# Altium schematic sheet 1_PowerSupply.SchDoc
size A4
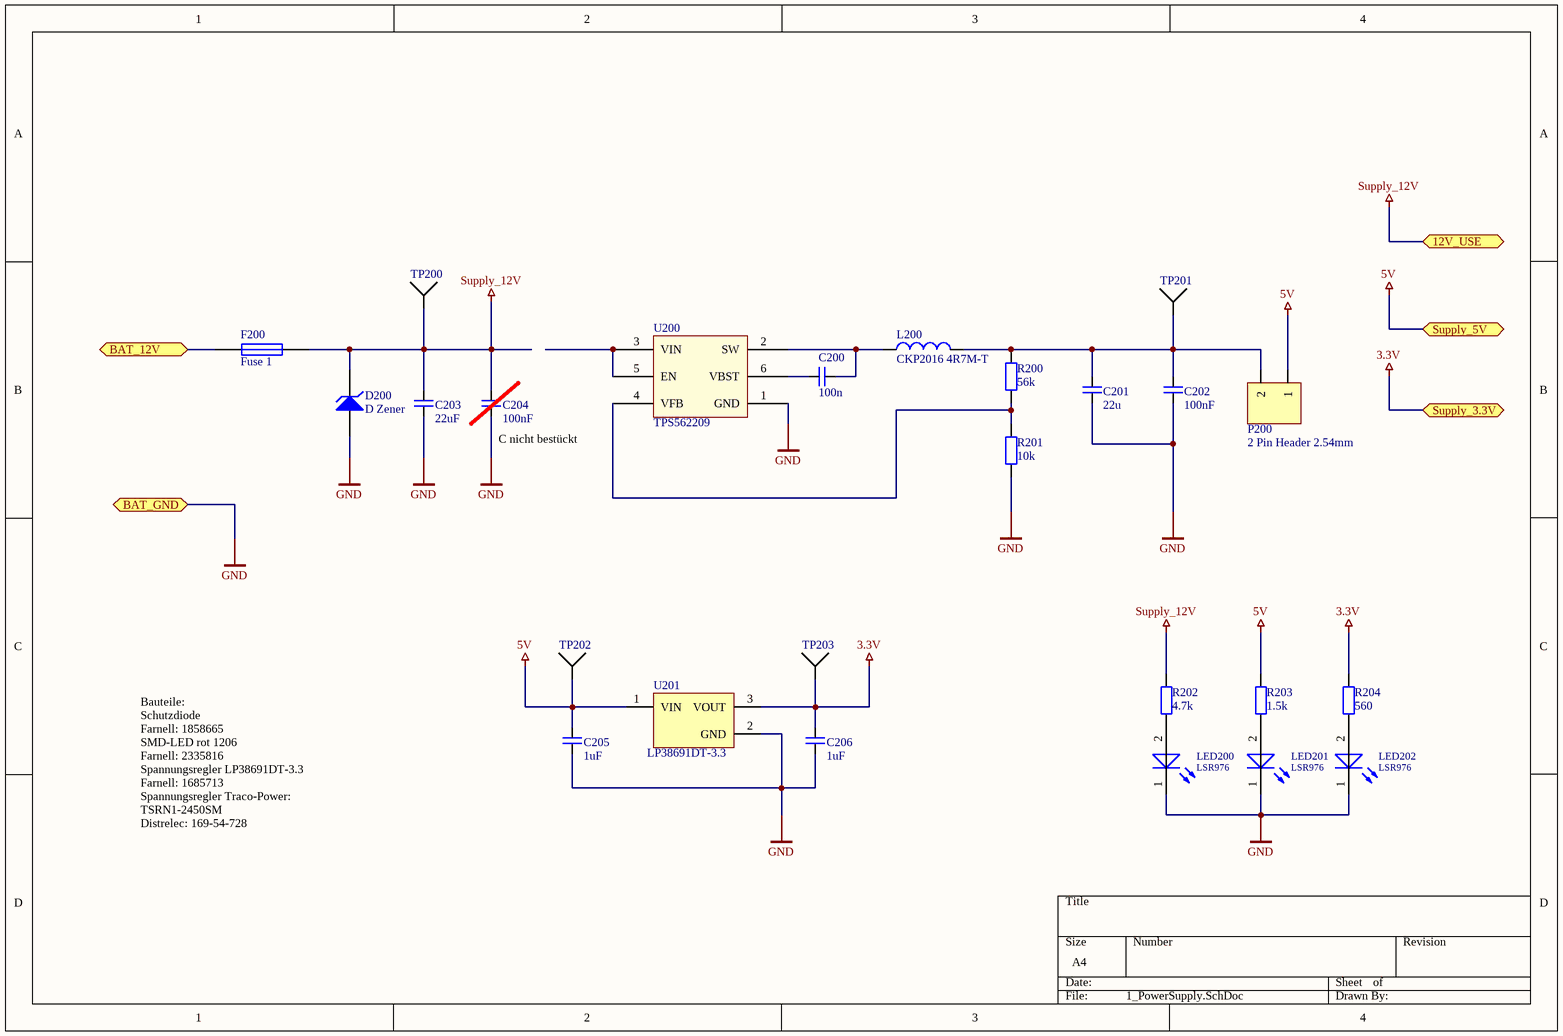
[diagram p0: 1_PowerSupply.SchDoc]

## Parts
C200  100n  [CAPC0805]
C201  22u  [C0805]
C202  100nF  [C0805]
C203  22uF  [CAPC0805]
C204  100nF  [CAPC0805]
C205  1uF  [CAPC0805]
C206  1uF  [CAPC0805]
D200  D Zener  [SMD_2Pin]
F200  Fuse 1  [Connector_2]
L200  CKP2016 4R7M-T  [IND0806]
LED200  LSR976  [CAPC1206]
LED201  LSR976  [CAPC1206]
LED202  LSR976  [CAPC1206]
P200  2 Pin Header 2.54mm  [2Pin Header 2.54mm]
R200  value 56k  [GEN_R0805_H]  (hidden comment: Generic)
R201  value 10k  [GEN_R0805_H]  (hidden comment: Generic)
R202  value 4.7k  [GEN_R0805_H]  (hidden comment: Generic)
R203  value 1.5k  [GEN_R0805_H]  (hidden comment: Generic)
R204  value 560  [GEN_R0805_H]  (hidden comment: Generic)
TP200  Testpunkt 1mm  [GEN_TP-THT-1.1mm_1_H]  (value not drawn)
TP201  Testpunkt 1mm  [GEN_TP-THT-1.1mm_1_H]  (value not drawn)
TP202  Testpunkt 1mm  [GEN_TP-THT-1.1mm_1_H]  (value not drawn)
TP203  Testpunkt 1mm  [GEN_TP-THT-1.1mm_1_H]  (value not drawn)
U200  TPS562209  [SOT23-6]
U201  LP38691DT-3.3  [TO_252_3]

## Ports
12V_USE, BAT_12V, BAT_GND, Supply_3.3V, Supply_5V

## Nets
3.3V: C206.1 R204.2 TP203.1 U201.3(VOUT) ; port Supply_3.3V
5V: C205.1 P200.1 R203.2 TP202.1 U201.1(VIN) ; port Supply_5V
GND: C201.2 C202.2 C203.2 C204.2 C205.2 C206.2 D200.1(A) LED200.1(K) LED201.1(K) LED202.1(K) R201.1 U200.1(GND) U201.2(GND) ; port BAT_GND
Supply_12V: C203.1 C204.1 D200.2(K) F200.2 R202.2 TP200.1 ; port 12V_USE
BAT_12V: F200.1 ; port BAT_12V
NetC200_1: C200.1 U200.6(VBST)
NetC200_2: C200.2 L200.1 U200.2(SW)
NetC201_1: C201.1 C202.1 L200.2 P200.2 R200.2 TP201.1
NetLED200_2: LED200.2(A) R202.1
NetLED201_2: LED201.2(A) R203.1
NetLED202_2: LED202.2(A) R204.1
NetR200_1: R200.1 R201.2 U200.4(VFB)
NetU200_3: U200.3(VIN) U200.5(EN)

## Notes on the sheet
- (near C204) C nicht bestückt
- Bauteile:
  Schutzdiode
  Farnell: 1858665
  SMD-LED rot 1206
  Farnell: 2335816
  Spannungsregler LP38691DT-3.3
  Farnell: 1685713
  Spannungsregler Traco-Power: TSRN1-2450SM
  Distrelec: 169-54-728

## Library data of the parts
C200 C203 = C Bipolar 0805: X7R MLCC 0805 (2012 Metric); Rated Voltage: 50V; Tolerance: 10%; Case-EIA: 0805; Case-Metric: 2012; Temperature Characteristics EIA: X7R; Temperature Range EIA: -55C/+125C
  C200: Value: 100n
  C203: Value: 22uF
C201 C202 = C Bipolar 1206: X7R MLCC 1206 (3016 Metric); Rated Voltage: 10V; Tolerance: 10%; Case-EIA: 1206; Case-Metric: 3216; Temperature Characteristics EIA: X7R; Temperature Range EIA: -55C/+125C
  C201: Value: 22u
  C202: Value: 100nF
C204-C206 = C Bipolar 0805: X7R MLCC 0805 (2012 Metric); Rated Voltage: 50V; Value: 100n; Tolerance: 10%; Case-EIA: 0805; Case-Metric: 2012; Temperature Characteristics EIA: X7R; Temperature Range EIA: -55C/+125C
D200 = D Zener: Zener Diode; Published: 8-Jun-2000; LatestRevisionDate: 17-Jul-2002; LatestRevisionNote: Re-released for DXP Platform.; PackageReference: DIODE-0.7; Publisher: Altium Limited; PackageDescription: Diode, Thru-Hole; 2 Leads; 0.7 in Pin Spacing
F200 = Fuse 1: Fuse; Published: 8-Jun-2000; LatestRevisionDate: 17-Jul-2002; LatestRevisionNote: Re-released for DXP Platform.; PackageReference: PIN-W2/E2.8; Publisher: Altium Limited; PackageDescription: Thru-Hole; 2 Leads
L200 = L: MULTILAYER CHIP POWER INDUCTORS; Manufactor: Taiyo Yuden; Current Rating: 900mA; DCR: 160mOhm; Inductance: 4u7; ComponentLink1Description: Datasheet Taiyo Yuden CK Series; ComponentLink1URL: V:\Inductor\Taiyo_Yuden_CK_Series.pdf
LED200-LED202 = OSR_LSR976_0805(1K2A): Hyper ChipLED, Red,; Manufacturer: OSRAM; #Class: DIODE; #ClassSub: LED; RefFootprint: GEN_LED0805_1K2A_2_H; ComponentLink1Description: Manufacturer Link; ComponentLink1URL: http://www.osram-os.com/osram_os/en/products/product-catalog/led-light-emitting-diodes/chipled/chipled-0805/ls-r976/index.jsp?search_result=%2fosram_os%2fen%2fsearch%2fadvanced_search.jsp%3faction%3ddosearch%26inp_searchterm_1%3dLS%2bR976%26website_name%3dosram_os_en; ComponentLink2Description: Datasheet; ComponentLink2URL: http://catalog.osram-os.com/catalogue/catalogue.do;jsessionid=8A0FA5146E77D3A917A5A5D383CD44B4?act=downloadFile&favOid=0200000600039319000100b6; ComponentLink3Description: Packaging Specification; ComponentLink3URL: http://catalog.osram-os.com/catalogue/catalogue.do;jsessionid=8A0FA5146E77D3A917A5A5D383CD44B4?act=downloadFile&favOid=0200000600039319000100b6; Distributor: Farnell; Manufacturer PartNr: LSR976; Distributor PartNr: 1226392; Published: 20121218; Publisher: Stefan Ursella, M.Eng; RefFileFOO: *; RefFileSCH: *; RefSchema: OSR_LSR976_0805(1K2A)
P200 = 2 Pin Connector
R200-R204 = GEN_R_2: generic resistor; Manufacturer: Tbd; #Class: PASSIVE; Published: 8-Jun-2000; Publisher: Altium Limited; #ClassSub: RESISTOR; ComponentLink1Description: Manufacturer Link; ComponentLink2Description: Datasheet; ComponentLink3Description: Packaging Specification; Distributor: tbd; RefFootprint: GEN_R0805_H; Manufacturer PartNr: tbd; Distributor PartNr: tbd; RefFileFOO: *; RefFileSCH: *; RefSchema: GEN_R_2
TP200-TP203 = Testpunkt 1mm: Manufacturer: Keystone Electronics; #Class: Connector; #ClassSub: Laborbuchse; Publisher: B.Sc. Ursella; Published: 2008-12-16; Supplier 1: Mouser; Supplier Part Number 1: 534-1035; Status: nLager; FootprintRef: GEN_TP-THT-1.1mm_1_H; RefFootprint: GEN_TP-THT-1.1mm_1_H; RefFileFOO: *; RefFileSCH: *; RefSchema: Testpunkt 1mm
U200 = TPS562209: 3-A Synchronous Step-Down Voltage Regulator; Manufactor: Texas Instruments; Order Nr.: TPS562209DDCR; ComponentLink1Description: Datasheet TPS56x209; ComponentLink1URL: V:\Power_Management_ICs\PWM_Cont\TPS56x209.pdf
U201 = MCP1700T-2302E/MB: Low Quiescent Current LDO, 3-Pin SOT-89, Extended Temperature, Tape and Reel; Published: 29-Jan-2009; DatasheetVersion: revB, Feb-2007; PackageVersion: revBB, Aug-2009; PackageReference: SOT-89-MB3; Publisher: Altium Limited; PackageDescription: 3-Lead Plastic Small Outline Transistor Header (MB) [SOT-89]; Code_IPC: SOT89; ComponentLink1Description: Datasheet; ComponentLink1URL: http://ww1.microchip.com/downloads/en/DeviceDoc/21826b.pdf; ComponentLink2Description: Packaging Specification; ComponentLink2URL: http://www.microchip.com/stellent/groups/techpub_sg/documents/packagingspec/en012702.pdf; ComponentLink3Description: Microchip.com Home; ComponentLink3URL: http://www.microchip.com/